# EAGLE design aery32 (EAGLE 6.4)

## Sheet 1 of 2
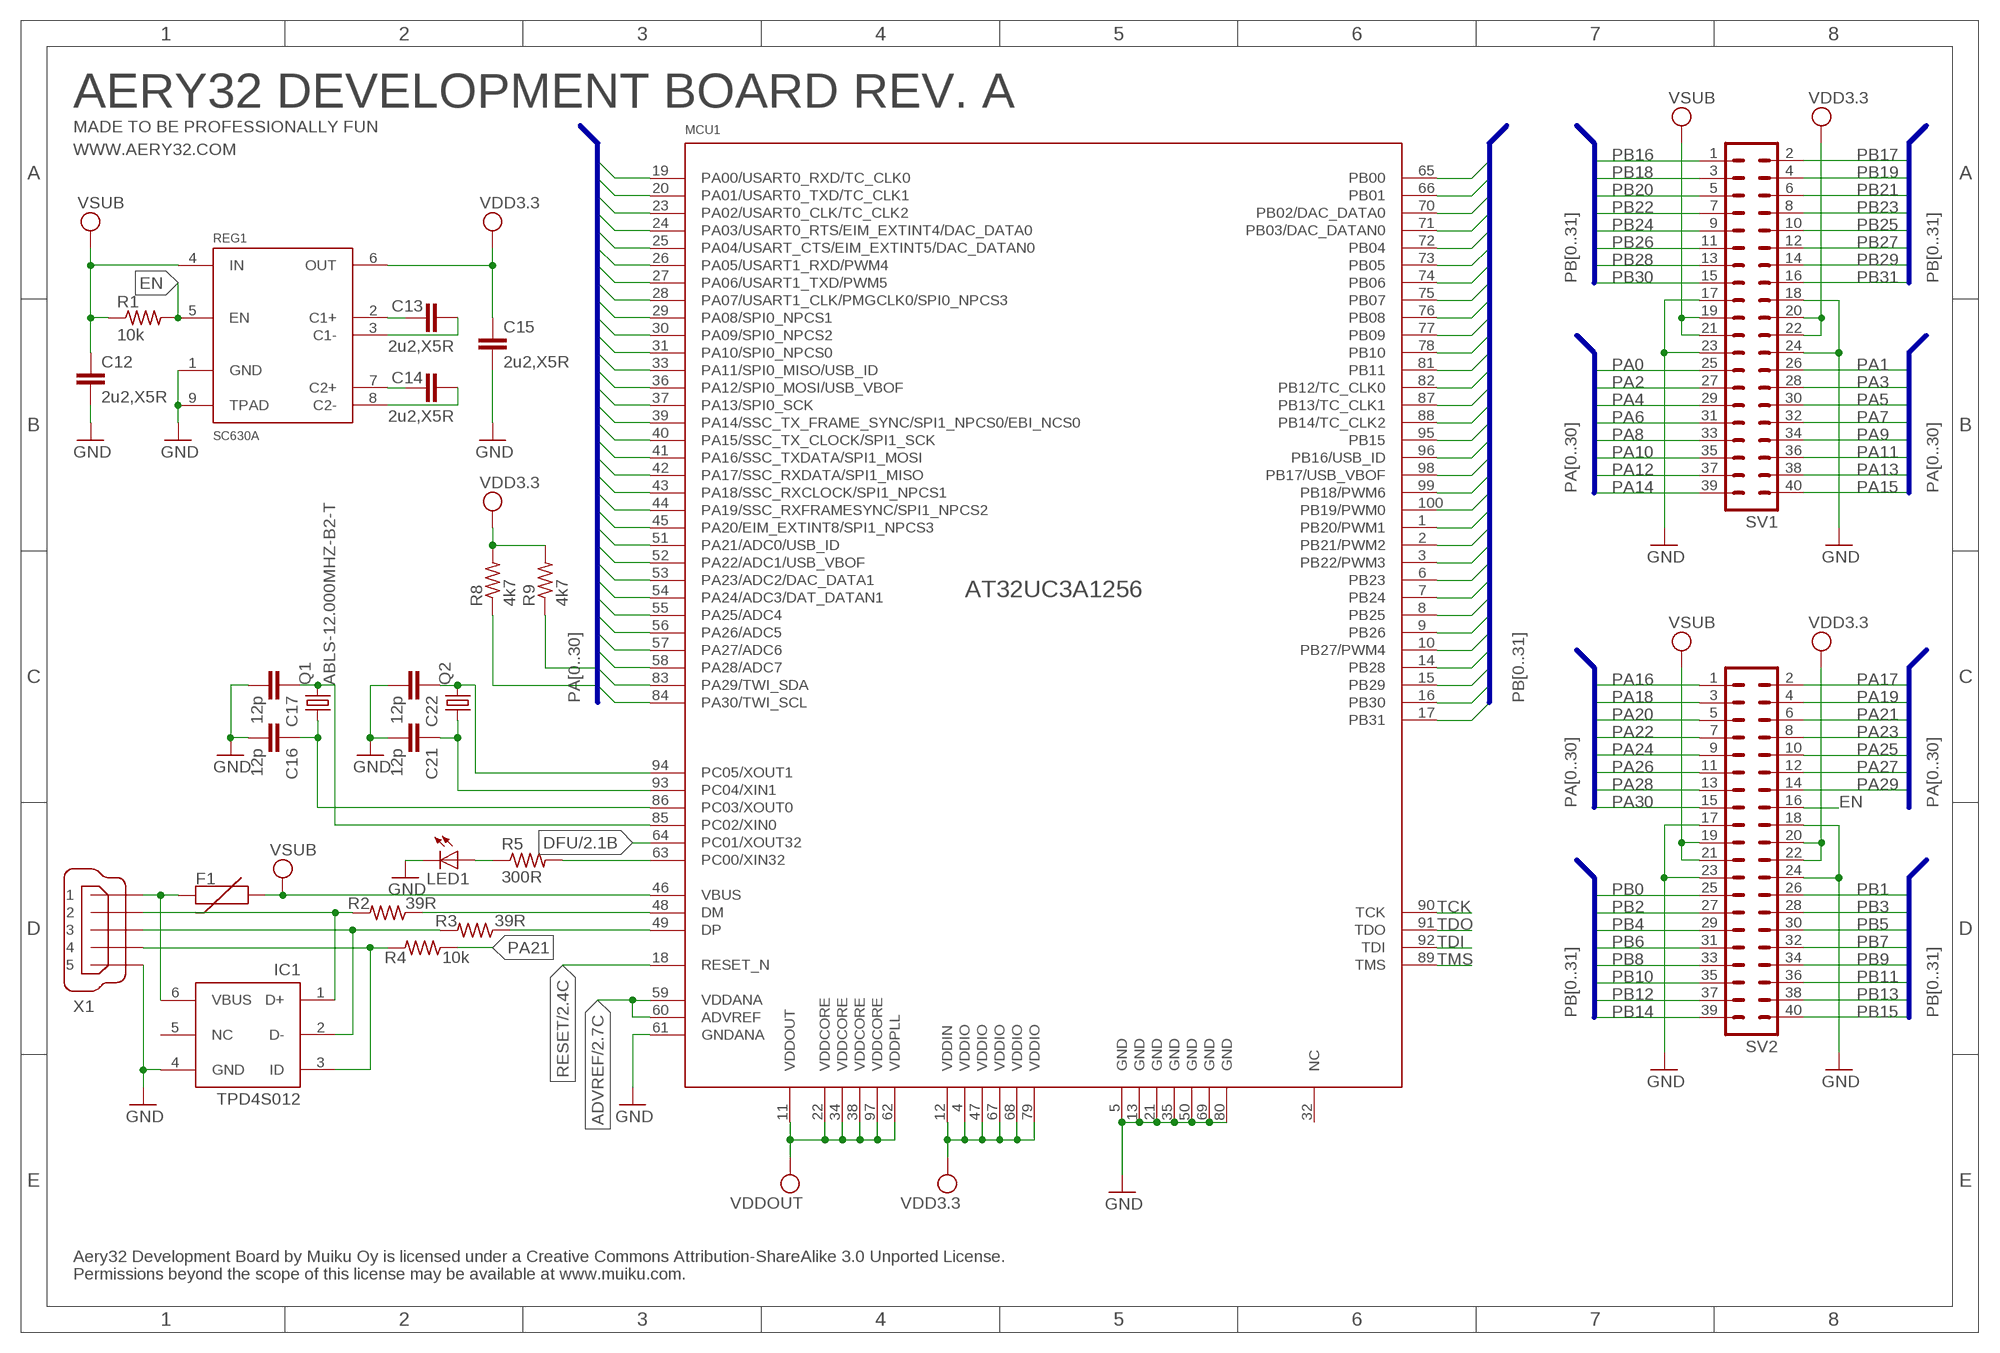
[diagram p0: schematic, sheet 1]

### Parts
C12  2u2,X5R  C-EUC0402  [C0402]
C13  2u2,X5R  C-EUC0402  [C0402]
C14  2u2,X5R  C-EUC0402  [C0402]
C15  2u2,X5R  C-EUC0402  [C0402]
C16  12p  C-EUC0402  [C0402]
C17  12p  C-EUC0402  [C0402]
C21  12p  C-EUC0402  [C0402]
C22  12p  C-EUC0402  [C0402]
F1  PTCSMD  [PTC-1206]
IC1  TPD4S012  [DRY]
LED1  LEDCHIPLED_0805  [CHIPLED_0805]
MCU1  AT32UC3A1256  AT32UC3A1128  [TQFP100]
Q1  ABLS-12.000MHZ-B2-T  CRYSTALHC49UP  [HC49UP]
Q2  CRYSTALTC38H  [TC38H]
R1  10k  R-US_R0402  [R0402]
R2  39R  R-US_R0402  [R0402]
R3  39R  R-US_R0402  [R0402]
R4  10k  R-US_R0402  [R0402]
R5  300R  R-US_R0402  [R0402]
R8  4k7  R-US_R0402  [R0402]
R9  4k7  R-US_R0402  [R0402]
REG1  SC630A  [MLPD-UT-8]
SV1  MA20-2  [MA20-2]
SV2  MA20-2  [MA20-2]
X1  USBMINI-B  MINIUSB  [MINIUSB]

### Nets
ADVREF: MCU1.59(VDDANA) MCU1.60(ADVREF) ; also sheet 2
DFU: MCU1.64(PC01/XOUT32) ; also sheet 2
EN: R1.2 REG1.5(EN) SV2.16
GND: C12.2 C15.2 C16.2 C17.2 C21.2 C22.2 IC1.4(GND) LED1.C MCU1.5(GND) MCU1.13(GND) MCU1.21(GND) MCU1.35(GND) MCU1.50(GND) MCU1.61(GNDANA) MCU1.69(GND) MCU1.80(GND) REG1.1(GND) REG1.9(TPAD) SV1.17 SV1.18 SV1.23 SV1.24 SV2.17 SV2.18 SV2.23 SV2.24 X1.5 ; also sheet 2
N$3: C13.1 REG1.2(C1+)
N$4: MCU1.63(PC00/XIN32) R5.2
N$5: IC1.3(ID) R4.2 X1.4
N$6: MCU1.48(DM) R2.1
N$7: MCU1.49(DP) R3.1
N$8: IC1.2(D-) R3.2 X1.3
N$9: IC1.1(D+) R2.2 X1.2
N$10: LED1.A R5.1
N$12: F1.2 IC1.6(VBUS) X1.1
N$13: C13.2 REG1.3(C1-)
N$14: C14.1 REG1.7(C2+)
N$15: C14.2 REG1.8(C2-)
N$16: C16.1 MCU1.86(PC03/XOUT0) Q1.1
N$18: C22.1 MCU1.94(PC05/XOUT1) Q2.2
N$19: C17.1 MCU1.85(PC02/XIN0) Q1.2
N$20: C21.1 MCU1.93(PC04/XIN1) Q2.1
PA0: MCU1.19(PA00/USART0_RXD/TC_CLK0) SV1.25
PA1: MCU1.20(PA01/USART0_TXD/TC_CLK1) SV1.26
PA2: MCU1.23(PA02/USART0_CLK/TC_CLK2) SV1.27
PA3: MCU1.24(PA03/USART0_RTS/EIM_EXTINT4/DAC_DATA0) SV1.28
PA4: MCU1.25(PA04/USART_CTS/EIM_EXTINT5/DAC_DATAN0) SV1.29
PA5: MCU1.26(PA05/USART1_RXD/PWM4) SV1.30
PA6: MCU1.27(PA06/USART1_TXD/PWM5) SV1.31
PA7: MCU1.28(PA07/USART1_CLK/PMGCLK0/SPI0_NPCS3) SV1.32
PA8: MCU1.29(PA08/SPI0_NPCS1) SV1.33
PA9: MCU1.30(PA09/SPI0_NPCS2) SV1.34
PA10: MCU1.31(PA10/SPI0_NPCS0) SV1.35
PA11: MCU1.33(PA11/SPI0_MISO/USB_ID) SV1.36
PA12: MCU1.36(PA12/SPI0_MOSI/USB_VBOF) SV1.37
PA13: MCU1.37(PA13/SPI0_SCK) SV1.38
PA14: MCU1.39(PA14/SSC_TX_FRAME_SYNC/SPI1_NPCS0/EBI_NCS0) SV1.39
PA15: MCU1.40(PA15/SSC_TX_CLOCK/SPI1_SCK) SV1.40
PA16: MCU1.41(PA16/SSC_TXDATA/SPI1_MOSI) SV2.1
PA17: MCU1.42(PA17/SSC_RXDATA/SPI1_MISO) SV2.2
PA18: MCU1.43(PA18/SSC_RXCLOCK/SPI1_NPCS1) SV2.3
PA19: MCU1.44(PA19/SSC_RXFRAMESYNC/SPI1_NPCS2) SV2.4
PA20: MCU1.45(PA20/EIM_EXTINT8/SPI1_NPCS3) SV2.5
PA21: MCU1.51(PA21/ADC0/USB_ID) R4.1 SV2.6
PA22: MCU1.52(PA22/ADC1/USB_VBOF) SV2.7
PA23: MCU1.53(PA23/ADC2/DAC_DATA1) SV2.8
PA24: MCU1.54(PA24/ADC3/DAT_DATAN1) SV2.9
PA25: MCU1.55(PA25/ADC4) SV2.10
PA26: MCU1.56(PA26/ADC5) SV2.11
PA27: MCU1.57(PA27/ADC6) SV2.12
PA28: MCU1.58(PA28/ADC7) SV2.13
PA29: MCU1.83(PA29/TWI_SDA) R9.1 SV2.14
PA30: MCU1.84(PA30/TWI_SCL) R8.1 SV2.15
PB0: MCU1.65(PB00) SV2.25
PB1: MCU1.66(PB01) SV2.26
PB2: MCU1.70(PB02/DAC_DATA0) SV2.27
PB3: MCU1.71(PB03/DAC_DATAN0) SV2.28
PB4: MCU1.72(PB04) SV2.29
PB5: MCU1.73(PB05) SV2.30
PB6: MCU1.74(PB06) SV2.31
PB7: MCU1.75(PB07) SV2.32
PB8: MCU1.76(PB08) SV2.33
PB9: MCU1.77(PB09) SV2.34
PB10: MCU1.78(PB10) SV2.35
PB11: MCU1.81(PB11) SV2.36
PB12: MCU1.82(PB12/TC_CLK0) SV2.37
PB13: MCU1.87(PB13/TC_CLK1) SV2.38
PB14: MCU1.88(PB14/TC_CLK2) SV2.39
PB15: MCU1.95(PB15) SV2.40
PB16: MCU1.96(PB16/USB_ID) SV1.1
PB17: MCU1.98(PB17/USB_VBOF) SV1.2
PB18: MCU1.99(PB18/PWM6) SV1.3
PB19: MCU1.100(PB19/PWM0) SV1.4
PB20: MCU1.1(PB20/PWM1) SV1.5
PB21: MCU1.2(PB21/PWM2) SV1.6
PB22: MCU1.3(PB22/PWM3) SV1.7
PB23: MCU1.6(PB23) SV1.8
PB24: MCU1.7(PB24) SV1.9
PB25: MCU1.8(PB25) SV1.10
PB26: MCU1.9(PB26) SV1.11
PB27: MCU1.10(PB27/PWM4) SV1.12
PB28: MCU1.14(PB28) SV1.13
PB29: MCU1.15(PB29) SV1.14
PB30: MCU1.16(PB30) SV1.15
PB31: MCU1.17(PB31) SV1.16
RESET: MCU1.18(RESET_N) ; also sheet 2
TCK: MCU1.90(TCK) ; also sheet 2
TDI: MCU1.92(TDI) ; also sheet 2
TDO: MCU1.91(TDO) ; also sheet 2
TMS: MCU1.89(TMS) ; also sheet 2
VBUS: C12.1 F1.1 MCU1.46(VBUS) R1.1 REG1.4(IN) SV1.19 SV1.21 SV2.19 SV2.21 ; supply symbol labelled _VBUS
VDD3.3: C15.1 MCU1.4(VDDIO) MCU1.12(VDDIN) MCU1.47(VDDIO) MCU1.67(VDDIO) MCU1.68(VDDIO) MCU1.79(VDDIO) R8.2 R9.2 REG1.6(OUT) SV1.20 SV1.22 SV2.20 SV2.22 ; supply symbol labelled _VDD3.3 ; also sheet 2
VDDOUT: MCU1.11(VDDOUT) MCU1.22(VDDCORE) MCU1.34(VDDCORE) MCU1.38(VDDCORE) MCU1.62(VDDPLL) MCU1.97(VDDCORE) ; supply symbol labelled _VDDOUT ; also sheet 2
Unconnected: IC1.5(NC) MCU1.32(NC)

### Buses
PA[0..30]
PB[0..31]

### Notes on the sheet
- AERY32 DEVELOPMENT BOARD REV. A
- MADE TO BE PROFESSIONALLY FUN
- WWW.AERY32.COM
- Aery32 Development Board by Muiku Oy is licensed under a Creative Commons Attribution-ShareAlike 3.0 Unported License.
- Permissions beyond the scope of this license may be available at www.muiku.com.

## Sheet 2 of 2
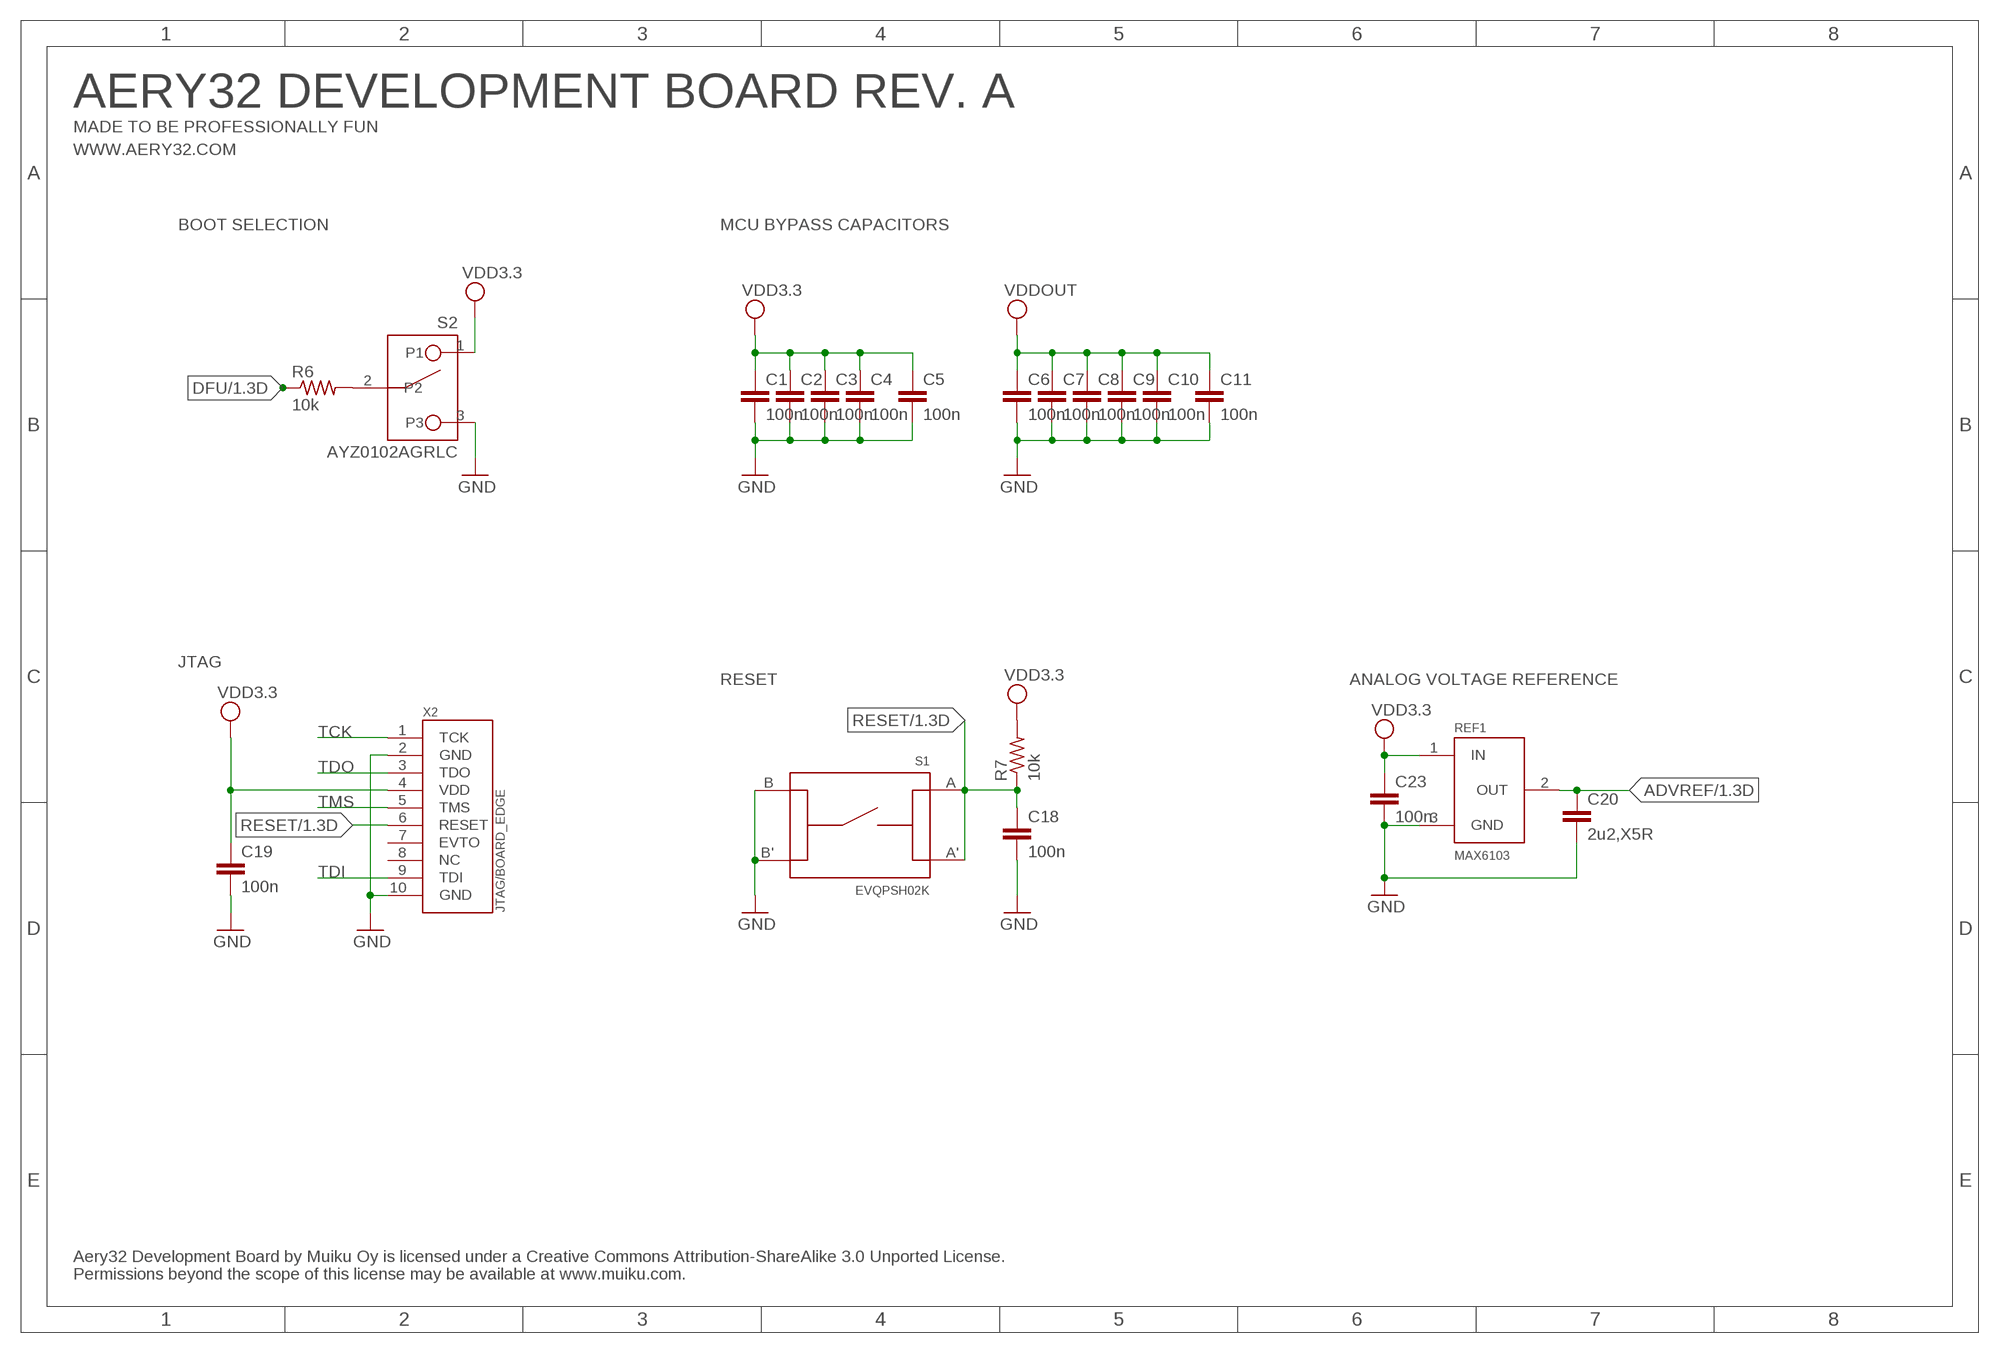
[diagram p1: schematic, sheet 2]

### Parts
C1  100n  C-EUC0402  [C0402]
C2  100n  C-EUC0402  [C0402]
C3  100n  C-EUC0402  [C0402]
C4  100n  C-EUC0402  [C0402]
C5  100n  C-EUC0402  [C0402]
C6  100n  C-EUC0402  [C0402]
C7  100n  C-EUC0402  [C0402]
C8  100n  C-EUC0402  [C0402]
C9  100n  C-EUC0402  [C0402]
C10  100n  C-EUC0402  [C0402]
C11  100n  C-EUC0402  [C0402]
C18  100n  C-EUC0402  [C0402]
C19  100n  C-EUC0402  [C0402]
C20  2u2,X5R  C-EUC0402  [C0402]
C23  100n  C-EUC0402  [C0402]
R6  10k  R-US_R0402  [R0402]
R7  10k  R-US_R0402  [R0402]
REF1  MAX6103  REF3320  [SOT23]
S1  EVQPSH02K  [EVQPSH02K]
S2  AYZ0102AGRLC  [AYZ0102AGRLC]
X2  JTAG/BOARD_EDGE  [JTAG/BOARD_EDGE]

### Nets
ADVREF: C20.1 REF1.2(OUT) ; also sheet 1
DFU: R6.1 ; also sheet 1
GND: C1.2 C2.2 C3.2 C4.2 C5.2 C6.2 C7.2 C8.2 C9.2 C10.2 C11.2 C18.2 C19.2 C20.2 C23.2 REF1.3(GND) S1.B S1.B' S2.3 X2.2(GND) X2.10(GND) ; also sheet 1
N$17: R6.2 S2.2
RESET: C18.1 R7.1 S1.A S1.A' X2.6(RESET) ; also sheet 1
TCK: X2.1(TCK) ; also sheet 1
TDI: X2.9(TDI) ; also sheet 1
TDO: X2.3(TDO) ; also sheet 1
TMS: X2.5(TMS) ; also sheet 1
VDD3.3: C1.1 C2.1 C3.1 C4.1 C5.1 C19.1 C23.1 R7.2 REF1.1(IN) S2.1 X2.4(VDD) ; supply symbol labelled _VDD3.3 ; also sheet 1
VDDOUT: C6.1 C7.1 C8.1 C9.1 C10.1 C11.1 ; supply symbol labelled _VDDOUT ; also sheet 1
Unconnected: X2.7(EVTO) X2.8(NC)

### Notes on the sheet
- AERY32 DEVELOPMENT BOARD REV. A
- MADE TO BE PROFESSIONALLY FUN
- WWW.AERY32.COM
- BOOT SELECTION | MCU BYPASS CAPACITORS
- JTAG
- RESET | ANALOG VOLTAGE REFERENCE
- Aery32 Development Board by Muiku Oy is licensed under a Creative Commons Attribution-ShareAlike 3.0 Unported License.
- Permissions beyond the scope of this license may be available at www.muiku.com.

## Library data of the parts
C1-C23 = rcl:C-EU: CAPACITOR, European symbol
F1 = SparkFun:PTC: Resettable Fuse PTC Resettable Fuse. Spark Fun Electronics SKU : COM-08357
IC1 = aery32:TPD4S012: Texas 4CH USB ESD Solution
LED1 = led:LED: LED OSRAM: - CHIPLED LG R971, LG N971, LY N971, LG Q971, LY Q971, LO R971, LY R971 LH N974, LH R974 LS Q976, LO Q976, LY Q976 LO Q996 - Hyper CHIPLED LW Q18S LB Q993, LB Q99A, LB R99A - SideLED LS A670, LO A670, LY A670, LG A670, LP A670 LB A673, LV A673, LT A673, LW A673 LH A674 LY A675 LS A676, LA A676, LO A676, LY A676, LW A676 LS A679, LY A679, LG A679 - Hyper Micro SIDELED® LS Y876, LA Y876, LO Y876, LY Y876 LT Y87S - SmartLED LW L88C, LW L88S LB L89C, LB L89S, LG L890 LS L89K, LO L89K, LY L89K LS L896, LA L896, LO L896, LY L896 - TOPLED LS T670, LO T670, LY T670, LG T670, LP T670 LSG T670, LSP T670, LSY T670, LOP T670, LYG T670 LG T671, LOG T671, LSG T671 LB T673, LV T673, LT T673, LW T673 LH T674 LS T676, LA T676, LO T676, LY T676, LB T676, LH T676, LSB T676, LW T676 LB T67C, LV T67C, LT T67C, LS T67K, LO T67K, LY T67K, LW E67C LS E67B, LA E67B, LO E67B, LY E67B, LB E67C, LV E67C, LT E67C LW T67C LS T679, LY T679, LG T679 LS T770, LO T770, LY T770, LG T770, LP T770 LB T773, LV T773, LT T773, LW T773 LH T774 LS E675, LA E675, LY E675, LS T675 LS T776, LA T776, LO T776, LY T776, LB T776 LHGB T686 LT T68C, LB T68C - Hyper Mini TOPLED® LB M676 - Mini TOPLED Santana® LG M470 LS M47K, LO M47K, LY M47K Source: http://www.osram.convergy.de LUXEON: - LUMILED® LXK2-PW12-R00, LXK2-PW12-S00, LXK2-PW14-U00, LXK2-PW14-V00 LXK2-PM12-R00, LXK2-PM12-S00, LXK2-PM14-U00 LXK2-PE12-Q00, LXK2-PE12-R00, LXK2-PE12-S00, LXK2-PE14-T00, LXK2-PE14-U00 LXK2-PB12-K00, LXK2-PB12-L00, LXK2-PB12-M00, LXK2-PB14-N00, LXK2-PB14-P00, LXK2-PB14-Q00 LXK2-PR12-L00, LXK2-PR12-M00, LXK2-PR14-Q00, LXK2-PR14-R00 LXK2-PD12-Q00, LXK2-PD12-R00, LXK2-PD12-S00 LXK2-PH12-R00, LXK2-PH12-S00 LXK2-PL12-P00, LXK2-PL12-Q00, LXK2-PL12-R00 Source: www.luxeon.com KINGBRIGHT: KA-3528ASYC Source: www.kingbright.com
MCU1 = kblom:AT32UC3A: High Performance, Low Power AVR®32 UC 32-Bit Microcontroller source <http://www.atmel.com/dyn/products/product_docs.asp?category_id=163&family_id=607&subfamily_id=2138&part_id=4122> mcu; DIGIKEY: AT32UC3A1256-AUT-ND; FARNELL: 1841636
Q1 = crystal:CRYSTAL: CRYSTAL; DIGIKEY: 535-9067-1-ND; OC_FARNELL: unknown; OC_NEWARK: unknown
Q2 = crystal:CRYSTAL: CRYSTAL; OC_FARNELL: unknown; OC_NEWARK: unknown
R1-R9 = rcl:R-US_: RESISTOR, American symbol
REF1 = kblom:REF: Voltage reference
REG1 = aery32:SC630A: Semtech 1MHz Fixed 3.3V Charge Pump Regulator; DIGIKEY: SC630AULCT-ND
S1 = aery32:EVQPS: Panasonic Light Touch Switches; DIGIKEY: P8089SCT-ND
S2 = aery32:AYZ: C&K - Miniature Slide Switches
SV1 SV2 = aery32:MA20-2: PIN HEADER; OC_FARNELL: unknown; OC_NEWARK: unknown
X1 = aery32:MINIUSB: MINI USB-B Conector
X2 = aery32:JTAG/BOARD_EDGE

## Board
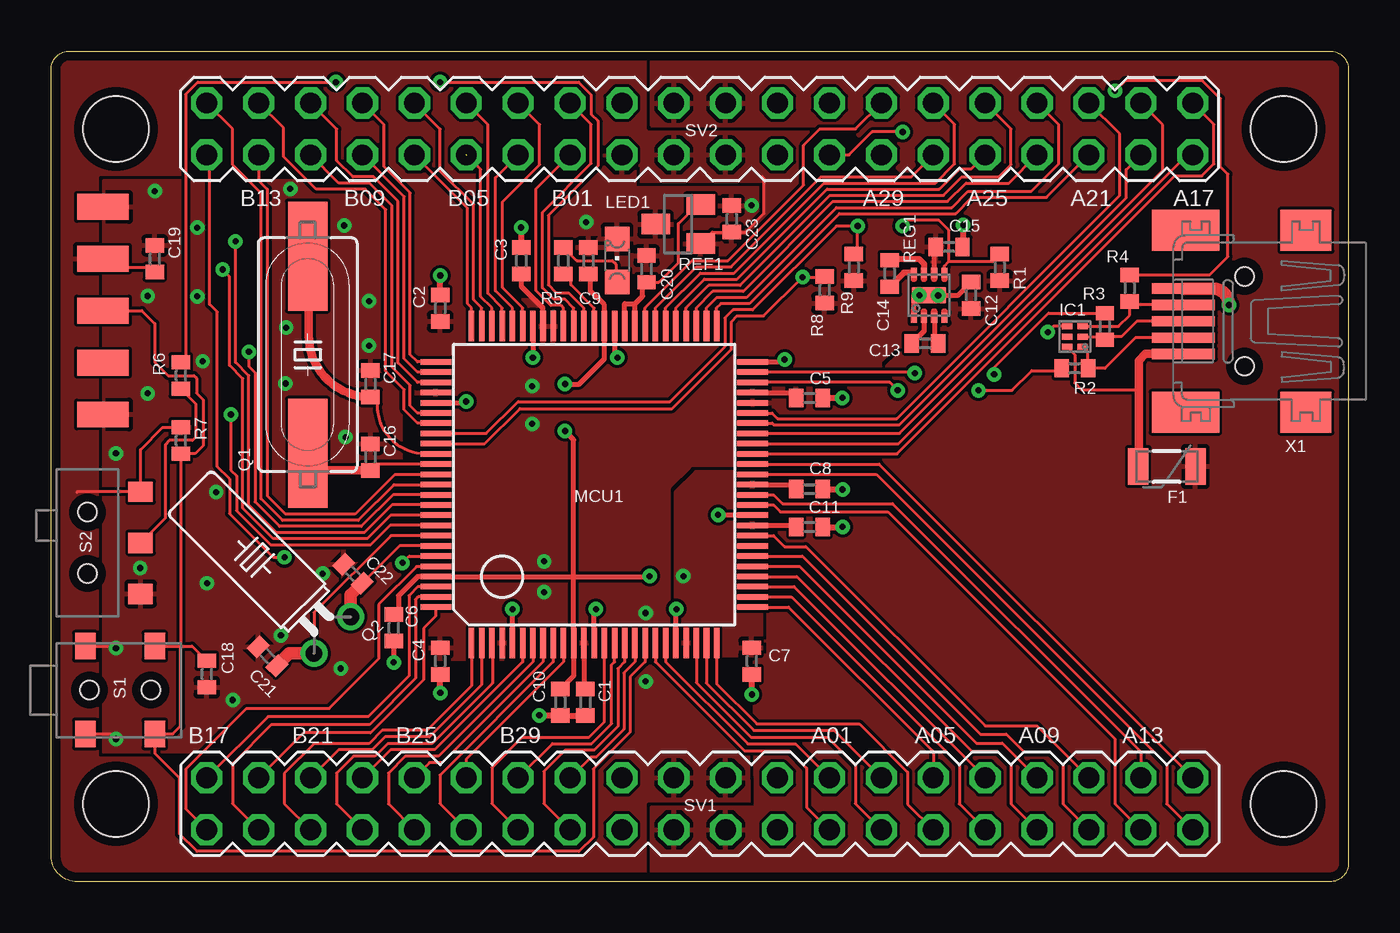
[diagram p2: board, top side]
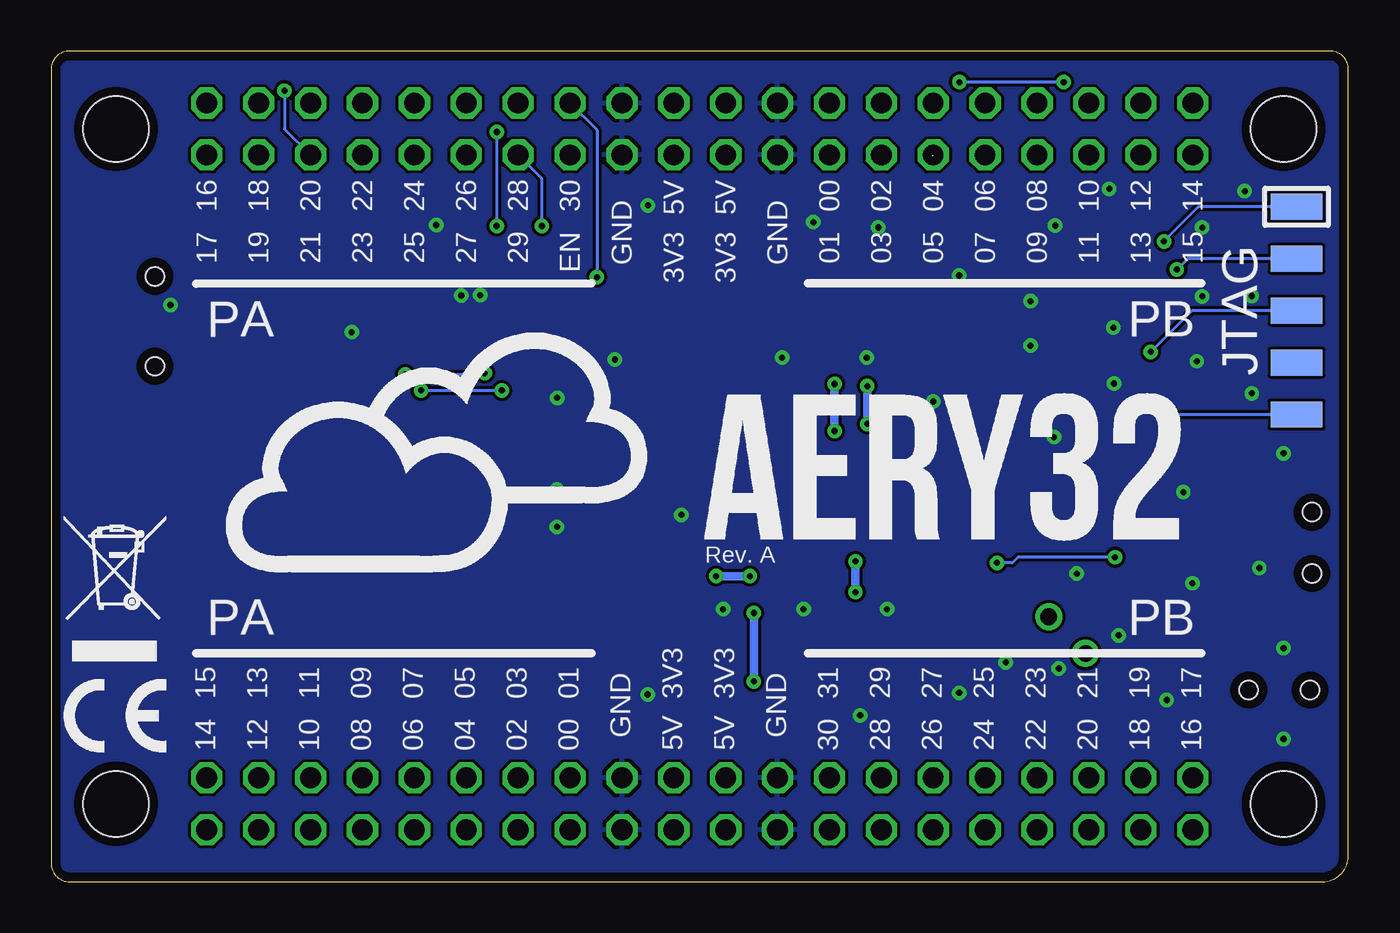
[diagram p3: board, bottom side, seen from below]

Size 63.5 x 40.64 mm. Coordinates in mm from the lower left corner, seen from the top.
Outline: 0.9,40.64 62.6,40.64 arc-90 63.5,39.74 63.5,0.9 arc-90 62.6,0 1.27,0 arc-90 0,1.27 0,39.74 arc-90 0.9,40.64
Copper layers (1*16): Top 0.035mm / dielectric 1.5mm / Bottom 0.035mm
Design rules "aery32 *": minimum track width 0.15mm, minimum drill 0.3mm, track to track 0.15mm, track to pad 0.15mm, pad to pad 0.15mm, via to via 0.15mm, smd to smd 0.15mm, copper to edge 0.45mm, drill to drill 0.3mm, minimum pad ring 10mil, minimum via ring 8mil, stop-mask expansion 4mil, vias tented up to drill 12mil, thermal gap 0.2mm
Holes 3.2 mm at 3.17,3.81 3.17,36.83 60.33,3.81 60.33,36.83

### Footprints (pad centres in the part's own frame; a part is rotated, then mirrored left to right if it is on the bottom)
C0402 = smd 0.7 x 0.9: 1 -0.65,0; 2 0.65,0
PTC-1206 = smd 1 x 1.8: 1 -1.4,0; 2 1.4,0
DRY = smd 0.3 x 0.52: 1 -0.5,-0.385; 2 0,-0.385; 3 0.5,-0.385; 4 0.5,0.385; 5 0,0.385; 6 -0.5,0.385
CHIPLED_0805 = smd 1.2 x 1.2: A 0,-1.05; C 0,1.05
TQFP100 = smd 0.27 x 1.5: 1 -6,-7.75; 2 -5.5,-7.75; 3 -5,-7.75; 4 -4.5,-7.75; 5 -4,-7.75; 6 -3.5,-7.75; 7 -3,-7.75; 8 -2.5,-7.75; 9 -2,-7.75; 10 -1.5,-7.75; 11 -1,-7.75; 12 -0.5,-7.75; 13 0,-7.75; 14 0.5,-7.75; 15 1,-7.75; 16 1.5,-7.75; 17 2,-7.75; 18 2.5,-7.75; 19 3,-7.75; 20 3.5,-7.75; 21 4,-7.75; 22 4.5,-7.75; 23 5,-7.75; 24 5.5,-7.75; 25 6,-7.75; 51 6,7.75; 52 5.5,7.75; 53 5,7.75; 54 4.5,7.75; 55 4,7.75; 56 3.5,7.75; 57 3,7.75; 58 2.5,7.75; 59 2,7.75; 60 1.5,7.75; 61 1,7.75; 62 0.5,7.75; 63 0,7.75; 64 -0.5,7.75; 65 -1,7.75; 66 -1.5,7.75; 67 -2,7.75; 68 -2.5,7.75; 69 -3,7.75; 70 -3.5,7.75; 71 -4,7.75; 72 -4.5,7.75; 73 -5,7.75; 74 -5.5,7.75; 75 -6,7.75 | smd 1.5 x 0.27: 26 7.75,-6; 27 7.75,-5.5; 28 7.75,-5; 29 7.75,-4.5; 30 7.75,-4; 31 7.75,-3.5; 32 7.75,-3; 33 7.75,-2.5; 34 7.75,-2; 35 7.75,-1.5; 36 7.75,-1; 37 7.75,-0.5; 38 7.75,0; 39 7.75,0.5; 40 7.75,1; 41 7.75,1.5; 42 7.75,2; 43 7.75,2.5; 44 7.75,3; 45 7.75,3.5; 46 7.75,4; 47 7.75,4.5; 48 7.75,5; 49 7.75,5.5; 50 7.75,6; 76 -7.75,6; 77 -7.75,5.5; 78 -7.75,5; 79 -7.75,4.5; 80 -7.75,4; 81 -7.75,3.5; 82 -7.75,3; 83 -7.75,2.5; 84 -7.75,2; 85 -7.75,1.5; 86 -7.75,1; 87 -7.75,0.5; 88 -7.75,0; 89 -7.75,-0.5; 90 -7.75,-1; 91 -7.75,-1.5; 92 -7.75,-2; 93 -7.75,-2.5; 94 -7.75,-3; 95 -7.75,-3.5; 96 -7.75,-4; 97 -7.75,-4.5; 98 -7.75,-5; 99 -7.75,-5.5; 100 -7.75,-6
HC49UP = smd 5.334 x 1.93: 1 -4.826,0; 2 4.826,0
TC38H = drill 0.813: 1 -1.27,0; 2 1.27,0
R0402 = smd 0.7 x 0.9: 1 -0.65,0; 2 0.65,0
SOT23 = smd 1 x 1.4: 1 -0.95,-1.1; 2 0.95,-1.1; 3 0,1.1
MLPD-UT-8 = smd 0.5 x 0.3: 1 -1.1,0.75; 2 -1.1,0.25; 3 -1.1,-0.25; 4 -1.1,-0.75; 5 1.1,-0.75; 6 1.1,-0.25; 7 1.1,0.25; 8 1.1,0.75 | smd 0.8 x 1.7: 9 0,0
EVQPSH02K = smd 1 x 1.3: A -1.7,2.15; A' -1.7,-2.15; B 1.7,2.15; B' 1.7,-2.15 | hole 0.9: 1.5,0; -1.5,0
AYZ0102AGRLC = smd 1 x 1.2: 1 -2.5,2.6; 2 0,2.6; 3 2.5,2.6 | hole 0.9: 1.5,0; -1.5,0
MA20-2 = drill 1.016 octagon: 1 -24.13,-1.27; 2 -24.13,1.27; 3 -21.59,-1.27; 4 -21.59,1.27; 5 -19.05,-1.27; 6 -19.05,1.27; 7 -16.51,-1.27; 8 -16.51,1.27; 9 -13.97,-1.27; 10 -13.97,1.27; 11 -11.43,-1.27; 12 -11.43,1.27; 13 -8.89,-1.27; 14 -8.89,1.27; 15 -6.35,-1.27; 16 -6.35,1.27; 17 -3.81,-1.27; 18 -3.81,1.27; 19 -1.27,-1.27; 20 -1.27,1.27; 21 1.27,-1.27; 22 1.27,1.27; 23 3.81,-1.27; 24 3.81,1.27; 25 6.35,-1.27; 26 6.35,1.27; 27 8.89,-1.27; 28 8.89,1.27; 29 11.43,-1.27; 30 11.43,1.27; 31 13.97,-1.27; 32 13.97,1.27; 33 16.51,-1.27; 34 16.51,1.27; 35 19.05,-1.27; 36 19.05,1.27; 37 21.59,-1.27; 38 21.59,1.27; 39 24.13,-1.27; 40 24.13,1.27
MINIUSB = smd 3.1 x 0.5: 1 3,1.6; 2 3,0.8; 3 3,0; 4 3,-0.8; 5 3,-1.6 | smd 2.5 x 2: M1 -3,-4.45; M2 -3,4.45 | smd 3.3 x 2: M3 2.9,4.45; M4 2.9,-4.45 | hole 0.9: 0,2.2; 0,-2.2
JTAG/BOARD_EDGE = smd 2.54 x 1.27: 1 0,5.08; 3 0,2.54; 5 0,0; 7 0,-2.54; 9 0,-5.08 | smd 2.54 x 1.27 bottom: 2 0,5.08; 4 0,2.54; 6 0,0; 8 0,-2.54; 10 0,-5.08

### Placement (x,y rotation side)
C1  26.16,8.78 270 top
C2  19.05,28.06 90 top
C3  23.02,30.38 90 top
C4  19.05,10.8 270 top
C5  37.12,23.67 0 top
C6  16.77,12.42 270 top
C7  34.29,10.8 270 top
C8  37.12,19.21 0 top
C9  26.3,30.38 90 top
C10  24.93,8.78 270 top
C11  37.12,17.36 0 top
C12  45.03,28.7 90 top
C13  42.77,26.34 0 top
C14  41.05,29.76 270 top
C15  43.95,31.06 0 top
C16  15.63,20.77 90 top
C17  15.63,24.36 90 top
C18  7.62,10.16 270 top
C19  5.08,30.48 90 top
C20  29.14,29.98 90 top
C21  10.6,11.03 135 top
C22  14.77,15.07 135 top
C23  33.31,32.44 90 top
F1  54.61,20.32 180 top
IC1  50.11,26.67 90 top
LED1  27.7,30.4 0 top
MCU1  26.58,19.43 0 top
Q1  12.56,25.78 90 top
Q2  13.77,12.07 45 top
R1  46.44,30.06 90 top
R2  50.11,25.12 0 top
R3  51.58,27.17 270 top
R4  52.8,29.04 270 top
R5  25.07,30.38 270 top
R6  6.35,24.77 270 top
R7  6.35,21.59 90 top
R8  37.86,28.96 270 top
R9  39.29,30.06 270 top
REF1  30.69,32.18 90 top
REG1  42.98,28.7 90 top
S1  3.38,9.38 180 top
S2  1.78,16.58 270 top
SV1  31.75,3.81 0 top
SV2  31.75,36.83 180 top
U$16  [CE/5MM-WIDE]  62.87,6.35 0 bottom
U$18  [WEEE/5MM-WIDE]  62.87,10.8 0 bottom
U$19  [LOGO/AERY32]  55.05,14.7 0 bottom
X1  58.42,27.42 180 top
X2  2.54,27.94 0 bottom

### Tracks (layer width: path | path; a pad name or v marks a point on that pad's centre or on a via)
ADVREF
  Top 0.15: C20.1 29.75,29.33 30.7,30.28 30.7,32.2 31.62,33.13 REF1.2
  Top 0.25: MCU1.59 28.58,28.28 | 28.58,28.28 28.95,28.65 28.95,29.33 C20.1 | MCU1.60 28.08,28.28 28.58,28.28
DFU  (via drill 0.3)
  Top 0.15: 26.08,27.16 MCU1.64 26.08,28.07 25.35,28.8 24.75,28.8 24.34,29.21 24.34,32.61 26.76,35.02 26.76,37.22 26.44,37.54 26.44,38.5 25.82,39.12 v19.04,39.12 | v13.94,39.12 7.18,39.12 6.58,38.52 6.58,25.59 R6.1
  Bottom 0.15: v13.94,39.12 v19.04,39.12
EN  (via drill 0.3)
  Top 0.15: v41.68,36.68 40.18,36.68 39.06,35.56 SV2.16 | REG1.5 43.73,30.13 43.95,30.35 | 43.95,30.35 43.95,31.87 43.44,32.38 41.98,32.38 v41.69,32.09 v41.69,32.08 | 43.95,30.35 46.08,30.35 R1.2
  Bottom 0.15: v41.68,36.68 v41.69,36.68 v41.69,32.08
GND  (via drill 0.3)
  Top 0.15: C11.2 | S1.B' 3.08,11.53 v3.17,11.43 | S1.B 2.93,7.23 v3.17,6.99 | v42.5,28.7 REG1.9 | IC1.4 49.07,27.17 v48.79,26.89
  Top 0.25: MCU1.35 32.67,17.93 v32.65,17.95 | MCU1.5 v22.58,13.34 | MCU1.13 26.58,13.25 v26.67,13.34 | MCU1.21 30.58,13.31 v30.61,13.34 | MCU1.80 20.26,23.43 v20.32,23.5 | MCU1.69 v23.58,25.64 | MCU1.61 27.58,25.78 v27.72,25.64 | MCU1.50 35.78,25.43 v35.9,25.55 | 26.14,8.14 C1.2 | 24.92,8.14 C10.2
  Top 0.254: REG1.1 42.23,28.7 REG1.9 | C12.2 44.37,28.68 v43.42,28.68 | C15.2 44.62,31.08 | C6.2 16.77,10.75 v16.77,10.73
  Top 0.305: C5.2 v38.73,23.67 | v23.9,8.14 24.92,8.14 | C10.2 C1.2 | v19.05,9.24 C4.2 | C7.2 v34.29,9.17 v34.3,9.16 | C8.2 38.72,19.21 v38.74,19.19 | C11.2 v38.73,17.36 v38.74,17.36 | C3.2 v23.02,32.01 v23.01,32.01 | C2.2 v19.05,29.66 | 44.62,31.08 44.65,31.08 v44.65,32.13
  Top 0.61: X1.5 56.86,29.02 arc-90 v57.66,28.22
  other vias: 11.47,24.38 11.5,27.11 14.35,32.11 15.56,28.4 15.56,26.23 11.7,33.9 4.36,15.35 8.89,8.89 7.63,14.61 14.41,21.75 34.29,33.1 13.29,15.08 5.08,33.79 7.42,25.47 8.08,19.06 7.16,28.64 7.16,32 26.19,32.28 4.73,28.66 3.17,20.96 4.73,23.89 14.18,10.43 11.25,12.05
  pour Bottom (isolate 0.15): -1.27,-1.27 64.77,-1.27 64.77,41.91 -1.27,41.91
  pour Top (isolate 0.15): 2.54,6.35 17.14,6.35 17.14,33.02 15.88,34.29 2.54,34.29
  pour Top (isolate 0.15): 22.23,28.58 22.23,35.56 28.57,35.56 28.57,33.97 36.83,33.97 36.83,33.66 31.75,28.58
N$1
  pour Top: 24.34,26.55 24.34,27.75 24.32,27.75 24.32,26.55
N$3
  Top 0.254: REG1.2 42.73,26.94 C13.1
N$4
  Top 0.15: MCU1.63 26.58,28.07 25.45,29.2 25.45,29.73 R5.2
N$5
  Top 0.15: X1.4 52.97,28.22 R4.2 52.8,27.72 52.25,27.17 IC1.3
N$6  (via drill 0.3)
  Top 0.15: MCU1.48 41.05,24.43 v41.44,24.04 | v45.39,24.04 47.04,24.04 48,25 49.34,25 R2.1
  Bottom 0.15: v45.39,24.04 v41.44,24.04
N$7  (via drill 0.3)
  Top 0.15: MCU1.49 42.23,24.93 v42.28,24.88 | v46.16,24.82 46.16,25.16 48.81,27.82 R3.1
  Bottom 0.15: v46.16,24.82 42.34,24.82 v42.28,24.88
N$8
  Top 0.15: IC1.2 51.5,26.67 R3.2 51.73,26.67 52.39,26.67 53.14,27.42 X1.3
N$9
  Top 0.15: R2.2 50.76,25.91 IC1.1 | X1.2 53.08,26.62 51.58,25.12 R2.2 | R2.2
N$10
  Top 0.15: R5.1 25.72,30.38 27.47,30.38 27.65,30.2 27.65,29.36 LED1.A
N$11
  cutout Top: 15.88,5.08 15.88,13.34 17.14,13.34 17.14,10.8 27.94,10.8 27.94,7.62 25.4,5.08
N$12
  Top 0.15: IC1.6 50.11,25.79 50.11,24.41 50.44,24.08 53.16,24.08 53.24,24
  Top 0.406: X1.1 53.56,25.82 53.24,25.5 53.24,24 53.24,20.35 F1.2 53.24,20.07
N$13
  Top 0.254: REG1.3 43.23,26.68 C13.2
N$14
  Top 0.305: REG1.7 42.73,30.24 42.5,30.46 41.06,30.46 C14.1
N$15
  Top 0.305: REG1.8 41.73,29.8 C14.2
N$16
  Top 0.15: MCU1.86 15.95,20.43 C16.1
  Top 0.406: C16.1 12.61,20.12 Q1.1
N$17
  Top 0.15: 4.48,16.48 S2.2 5.6,17.8 5.6,21.4 5.79,21.59 6.92,21.59 7.1,21.77 7.1,23.37 R6.2
N$18
  Top 0.15: MCU1.94 17.06,16.43 C22.1
  Top 0.61: Q2.2 14.67,14.05 C22.1
N$19
  Top 0.15: MCU1.85 18.33,20.93 arc-90 15.98,23.28 15.98,23.37 arc90 C17.1
  Top 0.406: C17.1 arc-90 12.61,26.74 12.61,30.56 Q1.2
N$20
  Top 0.15: MCU1.93 16.63,16.93 12.87,13.17 Q2.1
  Top 0.61: Q2.1 11.65,11.17 C21.1
N$21
  cutout Top: 21.59,28.58 24.27,28.58 24.27,36.2 21.59,36.2
PA0
  Top 0.15: MCU1.19 29.58,10.76 33.94,6.4 36.14,6.4 36.98,5.56 36.98,3.64 SV1.25
PA1
  Top 0.15: MCU1.20 30.08,10.76 34.1,6.74 36.44,6.74 SV1.26
PA2
  Top 0.15: MCU1.23 31.58,9.74 34.26,7.06 38,7.06 39.36,5.7 39.36,3.82 SV1.27
PA3
  Top 0.15: MCU1.24 32.08,9.72 34.4,7.4 38.32,7.4 SV1.28
PA4
  Top 0.15: MCU1.25 32.58,9.68 34.54,7.72 39.56,7.72 41.92,5.36 41.92,3.8 SV1.29
PA5
  Top 0.15: MCU1.26 36.1,13.43 43.18,6.35 SV1.30
PA6
  Top 0.15: MCU1.27 36.23,13.93 44.45,5.72 44.45,3.81 SV1.31
PA7
  Top 0.15: MCU1.28 36.37,14.43 SV1.32
PA8
  Top 0.15: MCU1.29 36.5,14.93 45.09,6.35 46.35,6.35 46.99,5.72 46.99,3.81 SV1.33
PA9
  Top 0.15: MCU1.30 36.64,15.43 45.28,6.79 46.55,6.79 SV1.34
PA10
  Top 0.15: SV1.35 49.53,3.81 49.53,5.72 48.9,6.35 47.62,6.35 46.76,7.22 45.48,7.22 36.77,15.93 MCU1.31
PA11
  Top 0.15: MCU1.33 35.37,16.93 35.9,16.4 36.94,16.4 45.72,7.62 48.26,7.62 SV1.36
PA12
  Top 0.15: MCU1.36 35.37,18.43 35.7,18.1 40.95,18.1 52.07,6.99 52.07,3.81 SV1.37
PA13
  Top 0.15: MCU1.37 35.37,18.93 35.8,18.5 41.19,18.5 53.34,6.35 SV1.38
PA14
  Top 0.15: MCU1.39 40.39,19.93 54.61,5.72 54.61,3.81 SV1.39
PA15
  Top 0.15: MCU1.40 40.53,20.43 SV1.40
PA16
  Top 0.15: MCU1.41 41.41,20.93 55.01,34.53 56.33,34.53 56.92,35.12 56.92,37.06 SV2.1
PA17
  Top 0.15: MCU1.42 41.48,21.43 55.61,35.56 SV2.2
PA18
  Top 0.15: SV2.3 54.41,37.03 54.41,34.81 41.53,21.93 MCU1.43
PA19
  Top 0.15: MCU1.44 35.29,22.43 35.36,22.36 41.53,22.36 52.62,33.46 52.62,34.85 SV2.4
PA20
  Top 0.15: 50.86,38.1 SV2.5 52.31,36.59 52.31,33.58 41.39,22.66 35.56,22.66 35.29,22.93 MCU1.45
PA21  (via drill 0.3)
  Top 0.15: MCU1.51 32.58,28.08 32.78,28.28 34.18,28.28 38.58,32.68 44.28,32.68 45.08,33.48 48.72,33.48 SV2.6 | v52.07,38.7 52.57,39.2 56.36,39.2 57.24,38.32 57.24,34.98 57.6,34.62 57.6,30.58 56.71,29.69 R4.1
  Bottom 0.15: v52.07,38.7 52.07,36.82 SV2.6
PA22
  Top 0.15: SV2.7 49.32,37.04 49.32,35.12 47.98,33.78 44.88,33.78 44.08,32.98 38.43,32.98 34.03,28.58 32.58,28.58 32.08,28.08 MCU1.52
PA23
  Top 0.15: SV2.8 46.88,34.18 44.78,34.18 43.88,33.28 38.28,33.28 33.88,28.88 32.38,28.88 31.58,28.08 MCU1.53
PA24
  Top 0.15: SV2.9 46.98,36.84 46.98,35.08 46.38,34.48 44.58,34.48 43.68,33.58 38.13,33.58 33.73,29.18 32.18,29.18 31.08,28.08 MCU1.54
PA25
  Top 0.15: SV2.10 45.04,34.88 44.48,34.88 43.48,33.88 37.98,33.88 33.58,29.48 31.98,29.48 30.58,28.08 MCU1.55
PA26
  Top 0.15: SV2.11 44.22,37.06 44.22,35.12 43.28,34.18 37.83,34.18 33.43,29.78 31.78,29.78 30.08,28.08 MCU1.56
PA27
  Top 0.15: MCU1.57 29.58,28.08 31.58,30.08 33.28,30.08 37.68,34.48 42.1,34.48 SV2.12
PA28
  Top 0.15: SV2.13 39.37,36.83 37.63,36.83 36.83,36.03 36.83,34.08 33.13,30.38 31.38,30.38 29.08,28.08 MCU1.58
PA29  (via drill 0.3)
  Top 0.15: MCU1.83 21.3,21.93 22.86,23.5 30.29,23.5 32.98,26.18 32.98,27.58 33.38,27.98 34.33,27.98 38.43,32.08 v39.48,32.08 39.48,30.71 R9.1
  Bottom 0.15: v39.48,32.08 39.48,34.4 SV2.14
PA30  (via drill 0.3)
  Top 0.15: MCU1.84 21.23,21.43 22.95,23.15 30.4,23.15 33.28,26.03 33.28,27.38 33.58,27.68 34.88,27.68 v36.78,29.58 37.86,29.58 R8.1
  Bottom 0.15: SV2.15 36.78,36.78 v36.78,29.58
PB0
  Top 0.15: MCU1.65 25.58,28.07 25.15,28.5 24.6,28.5 24.05,29.06 24.05,32.75 26.44,35.14 26.44,37.06 SV2.25
PB1
  Top 0.15: SV2.26 23.75,33.91 23.75,28.91 24.45,28.2 24.95,28.2 25.08,28.07 MCU1.66
PB2
  Top 0.15: SV2.27 23.92,37.05 23.92,35.09 22.1,33.27 22.1,29.06 23.08,28.08 MCU1.70
PB3
  Top 0.15: MCU1.71 22.58,28.08 21.75,28.91 21.75,34.45 SV2.28
PB4
  Top 0.15: MCU1.72 22.08,28.08 21.38,28.78 21.38,37.04 SV2.29
PB5  (1 unrouted)
  Top 0.15: MCU1.73 21.58,28.08 21.03,28.63 21.03,34.85 20.36,35.53
PB6
  Top 0.15: SV2.31 19.05,36.82 19.05,34.76 20.68,33.14 20.68,28.48 21.08,28.08 MCU1.74
PB7
  Top 0.15: MCU1.75 20.58,28.08 20.38,28.28 20.38,32.96 SV2.32
PB8
  Top 0.15: SV2.33 16.3,37.04 16.3,34.98 17.58,33.7 17.58,25.78 17.93,25.43 MCU1.76
PB9
  Top 0.15: SV2.34 17.28,33.52 17.28,25.58 17.93,24.93 MCU1.77
PB10
  Top 0.15: SV2.35 13.98,36.82 13.98,35.28 14.78,34.48 15.78,34.48 16.98,33.28 16.98,25.38 17.93,24.43 MCU1.78
PB11
  Top 0.15: SV2.36 14.08,34.18 15.58,34.18 16.68,33.08 16.68,25.18 17.58,24.28 17.58,23.28 17.93,22.93 MCU1.81
PB12
  Top 0.15: SV2.37 11.38,36.88 11.38,35.48 12.98,33.88 15.38,33.88 16.38,32.88 16.38,24.98 17.28,24.08 17.28,23.08 17.93,22.43 MCU1.82
PB13
  Top 0.15: SV2.38 10.16,34.3 10.58,33.88 10.58,18.88 11.48,17.98 14.88,17.98 16.83,19.93 MCU1.87
PB14
  Top 0.15: SV2.39 8.88,36.84 8.88,35.08 10.28,33.68 10.28,18.73 11.33,17.68 15.03,17.68 16.78,19.43 MCU1.88
PB15  (via drill 0.3)
  Top 0.15: SV2.40 7.76,35.42 7.76,28.25 8.13,27.88 8.13,20.31 8.73,19.71 8.73,18.01 10.86,15.88 v11.43,15.88 | v17.2,15.6 17.53,15.93 MCU1.95
  Bottom 0.15: v17.2,15.6 16.45,15.6 16.18,15.88 v11.43,15.88
PB16
  Top 0.15: SV1.1 6.6,3.56 6.6,5.5 9.58,8.48 13.61,8.48 16.04,10.91 16.04,13.57 17.89,15.42 18.82,15.42 MCU1.96
PB17
  Top 0.15: SV1.2 10.62,8.08 15.53,8.08 17.52,10.07 17.52,14 17.95,14.43 MCU1.98
PB18
  Top 0.15: SV1.3 8.88,3.82 8.88,5.78 10.78,7.68 15.58,7.68 17.84,9.94 17.84,13.8 17.97,13.93 MCU1.99
PB19
  Top 0.15: SV1.4 12.36,7.28 15.63,7.28 18.24,9.89 18.24,12.4 18.83,12.99 MCU1.100
PB20
  Top 0.15: MCU1.1 20.58,9.58 18.4,7.4 16.2,7.4 15.56,6.76 12.88,6.76 11.42,5.3 11.42,3.82 SV1.5
PB21
  Top 0.15: MCU1.2 21.08,9.64 18.52,7.08 16.34,7.08 15.72,6.46 14.08,6.46 SV1.6
PB22
  Top 0.15: MCU1.3 21.6,11.66 21.6,9.72 18.64,6.76 16.48,6.76 15.86,6.14 14.8,6.14 13.97,5.31 13.97,3.81 SV1.7
PB23
  Top 0.15: MCU1.6 23.08,10.76 18.78,6.46 16.62,6.46 SV1.8
PB24
  Top 0.15: MCU1.7 23.58,10.76 18.96,6.14 17.34,6.14 16.51,5.31 16.51,3.81 SV1.9
PB25
  Top 0.15: MCU1.8 24.08,10.76 19.14,5.82 18.52,5.82 SV1.10
PB26
  Top 0.15: MCU1.9 24.58,10.76 19.04,5.22 19.04,3.82 SV1.11
PB27
  Top 0.15: MCU1.10 25.08,10.76 20.32,6 SV1.12
PB28
  Top 0.15: SV1.13 21.58,3.82 21.58,5.58 23.06,7.06 26.32,7.06 27.08,7.82 MCU1.14
PB29
  Top 0.15: SV1.14 24.54,6.76 26.46,6.76 27.44,7.74 27.44,10.62 27.58,10.76 MCU1.15
PB30
  Top 0.15: MCU1.16 28.08,10.76 27.74,10.42 27.74,7.6 26.58,6.44 25.16,6.44 24.12,5.4 24.12,3.82 SV1.15
PB31
  Top 0.15: MCU1.17 28.58,10.76 28.04,10.22 28.04,7.46 26.68,6.1 26.42,6.1 SV1.16
RESET
  Top 0.15: S1.A' 6.35,11.53 | 6.35,11.53 6.9,11.53 C18.1 | 6.35,11.53 R7.1 7.05,20.94 7.44,21.33 7.44,23.59 7.12,23.91 7.12,24.63 6.98,24.77 5.72,24.77 5.08,25.4 5.08,27.31 4.45,27.94 X2.6 | MCU1.18 29.08,10.76 28.34,10.02 28.34,7.32 26.54,5.52 26.54,2.18 25.84,1.48 7.14,1.48 6.28,2.34 6.28,5.08 5.08,6.28 S1.A 5.96,7.23 6.35,7.62 6.35,11.53
TCK  (via drill 0.3)
  Top 0.15: MCU1.90 16.68,18.43 15.33,17.08 11.03,17.08 9.68,18.43 9.68,24.76 9.03,25.41 v9.03,31.33
  Bottom 0.15: X2.1 7.34,33.02 v9.03,31.33
TDI  (via drill 0.3)
  Top 0.15: v8.8,22.86 8.8,20.14 9.08,19.86 9.08,18.15 10.75,16.48 15.64,16.48 16.59,17.43 MCU1.92
  Bottom 0.15: v8.8,22.86 X2.9
TDO  (via drill 0.3)
  Top 0.15: MCU1.91 16.63,17.93 15.48,16.78 10.88,16.78 9.38,18.28 9.38,24.61 8.73,25.26 8.73,29.6 v8.4,29.95
  Bottom 0.15: X2.3 7.87,30.48 v8.4,29.95
TMS  (via drill 0.3)
  Top 0.15: MCU1.89 16.73,18.93 15.18,17.38 11.18,17.38 9.98,18.58 9.98,24.91 9.68,25.21 v9.68,25.92
  Bottom 0.15: X2.5 7.66,27.94 v9.68,25.92
VBUS
  pour Top (isolate 0.15, rank 3): 29.37,-2.54 66.04,-2.54 66.04,43.18 29.37,43.18 29.37,36.99 38.89,36.99 43.7,32.97 43.9,28.1 40.37,24.77 34.29,24.77 34.45,3.65 29.37,3.65
VDD3.3  (via drill 0.3)
  Top 0.15: 1.27,19.05 1.27,19.08 S2.1 4.38,21.15 5.46,22.23 6.33,22.23 R7.2 | REF1.1 32.35,31.79 C23.1 33.98,31.79 34.9,32.7 34.9,34.4 34.8,34.5 | X2.4 2.96,30.06 5.08,30.06 C19.1
  Top 0.25: MCU1.47 36.21,23.93 C5.1
  Top 0.254: REG1.6 43.23,30.72 C15.1 | MCU1.68 24.08,28.06 23.02,29.12 C3.1 | MCU1.12 26.08,9.5 C1.1
  Bottom 0.406: v24.13,14.17 v24.13,15.68 | v29.1,9.8 v29.1,13.15 | v23.55,22.4 v23.55,24.25
  pour Top (isolate 0.15, rank 4): 45.72,-3.81 -2.54,-3.81 -2.54,44.45 45.72,44.45
VDDOUT  (via drill 0.3)
  Top 0.25: v25.15,24.35 25.85,24.35 27.08,25.58 MCU1.62 | v25.15,22.05 25.58,21.62 25.58,14.93 | MCU1.97 25.58,14.93 | 25.58,14.93 29.28,14.93 v29.3,14.95 | 25.58,14.93 MCU1.11 25.58,10.08 C10.1 | MCU1.38 36.25,19.43 C8.1 | MCU1.34 36.39,17.43 C11.1
  Top 0.254: MCU1.97 17.93,14.93 17,14 17,13.3 C6.1 | MCU1.62 27.08,28.22 26.4,28.9 26.4,29.64 C9.1
  Bottom 0.406: v25.15,22.05 v25.15,24.35 | v29.3,14.95 v30.95,14.95
  pour Top (isolate 0.15): 31.16,11.06 34.8,11.06 34.82,20.06 31.53,20.06 30.54,19.07 30.54,11.68

### Text on the board
tPlace: B13 | B09 | B05 | B01 | A29 | A25 | A21 | A17 | B17 | B21 | B25 | B29 | A01 | A05 | A09 | A13
bPlace: Rev. A
bNames: 14 | 12 | 10 | 08 | 06 | 04 | 02 | 00 | 5V | 5V | 30 | 28 | 26 | 24 | 22 | 20 | 18 | 16 | GND | GND | 15 | 13 | 11 | 09 | 07 | 05 | 03 | 01 | 3V3 | 3V3 | EN | 29 | 27 | 25 | 23 | 21 | 19 | 17 | PB | PA | JTAG | PB | PA | 17 | 19 | 21 | 23 | 25 | 27 | 29 | 31 | 3V3 | 3V3 | 01 | 03 | 05 | 07 | 09 | 11 | 13 | 15 | GND | GND | 16 | 18 | 20 | 22 | 24 | 26 | 28 | 30 | 5V | 5V | 00 | 02 | 04 | 06 | 08 | 10 | 12 | 14